# EAGLE design Spectroscilloscope Revised_4 (EAGLE 9.6.2)
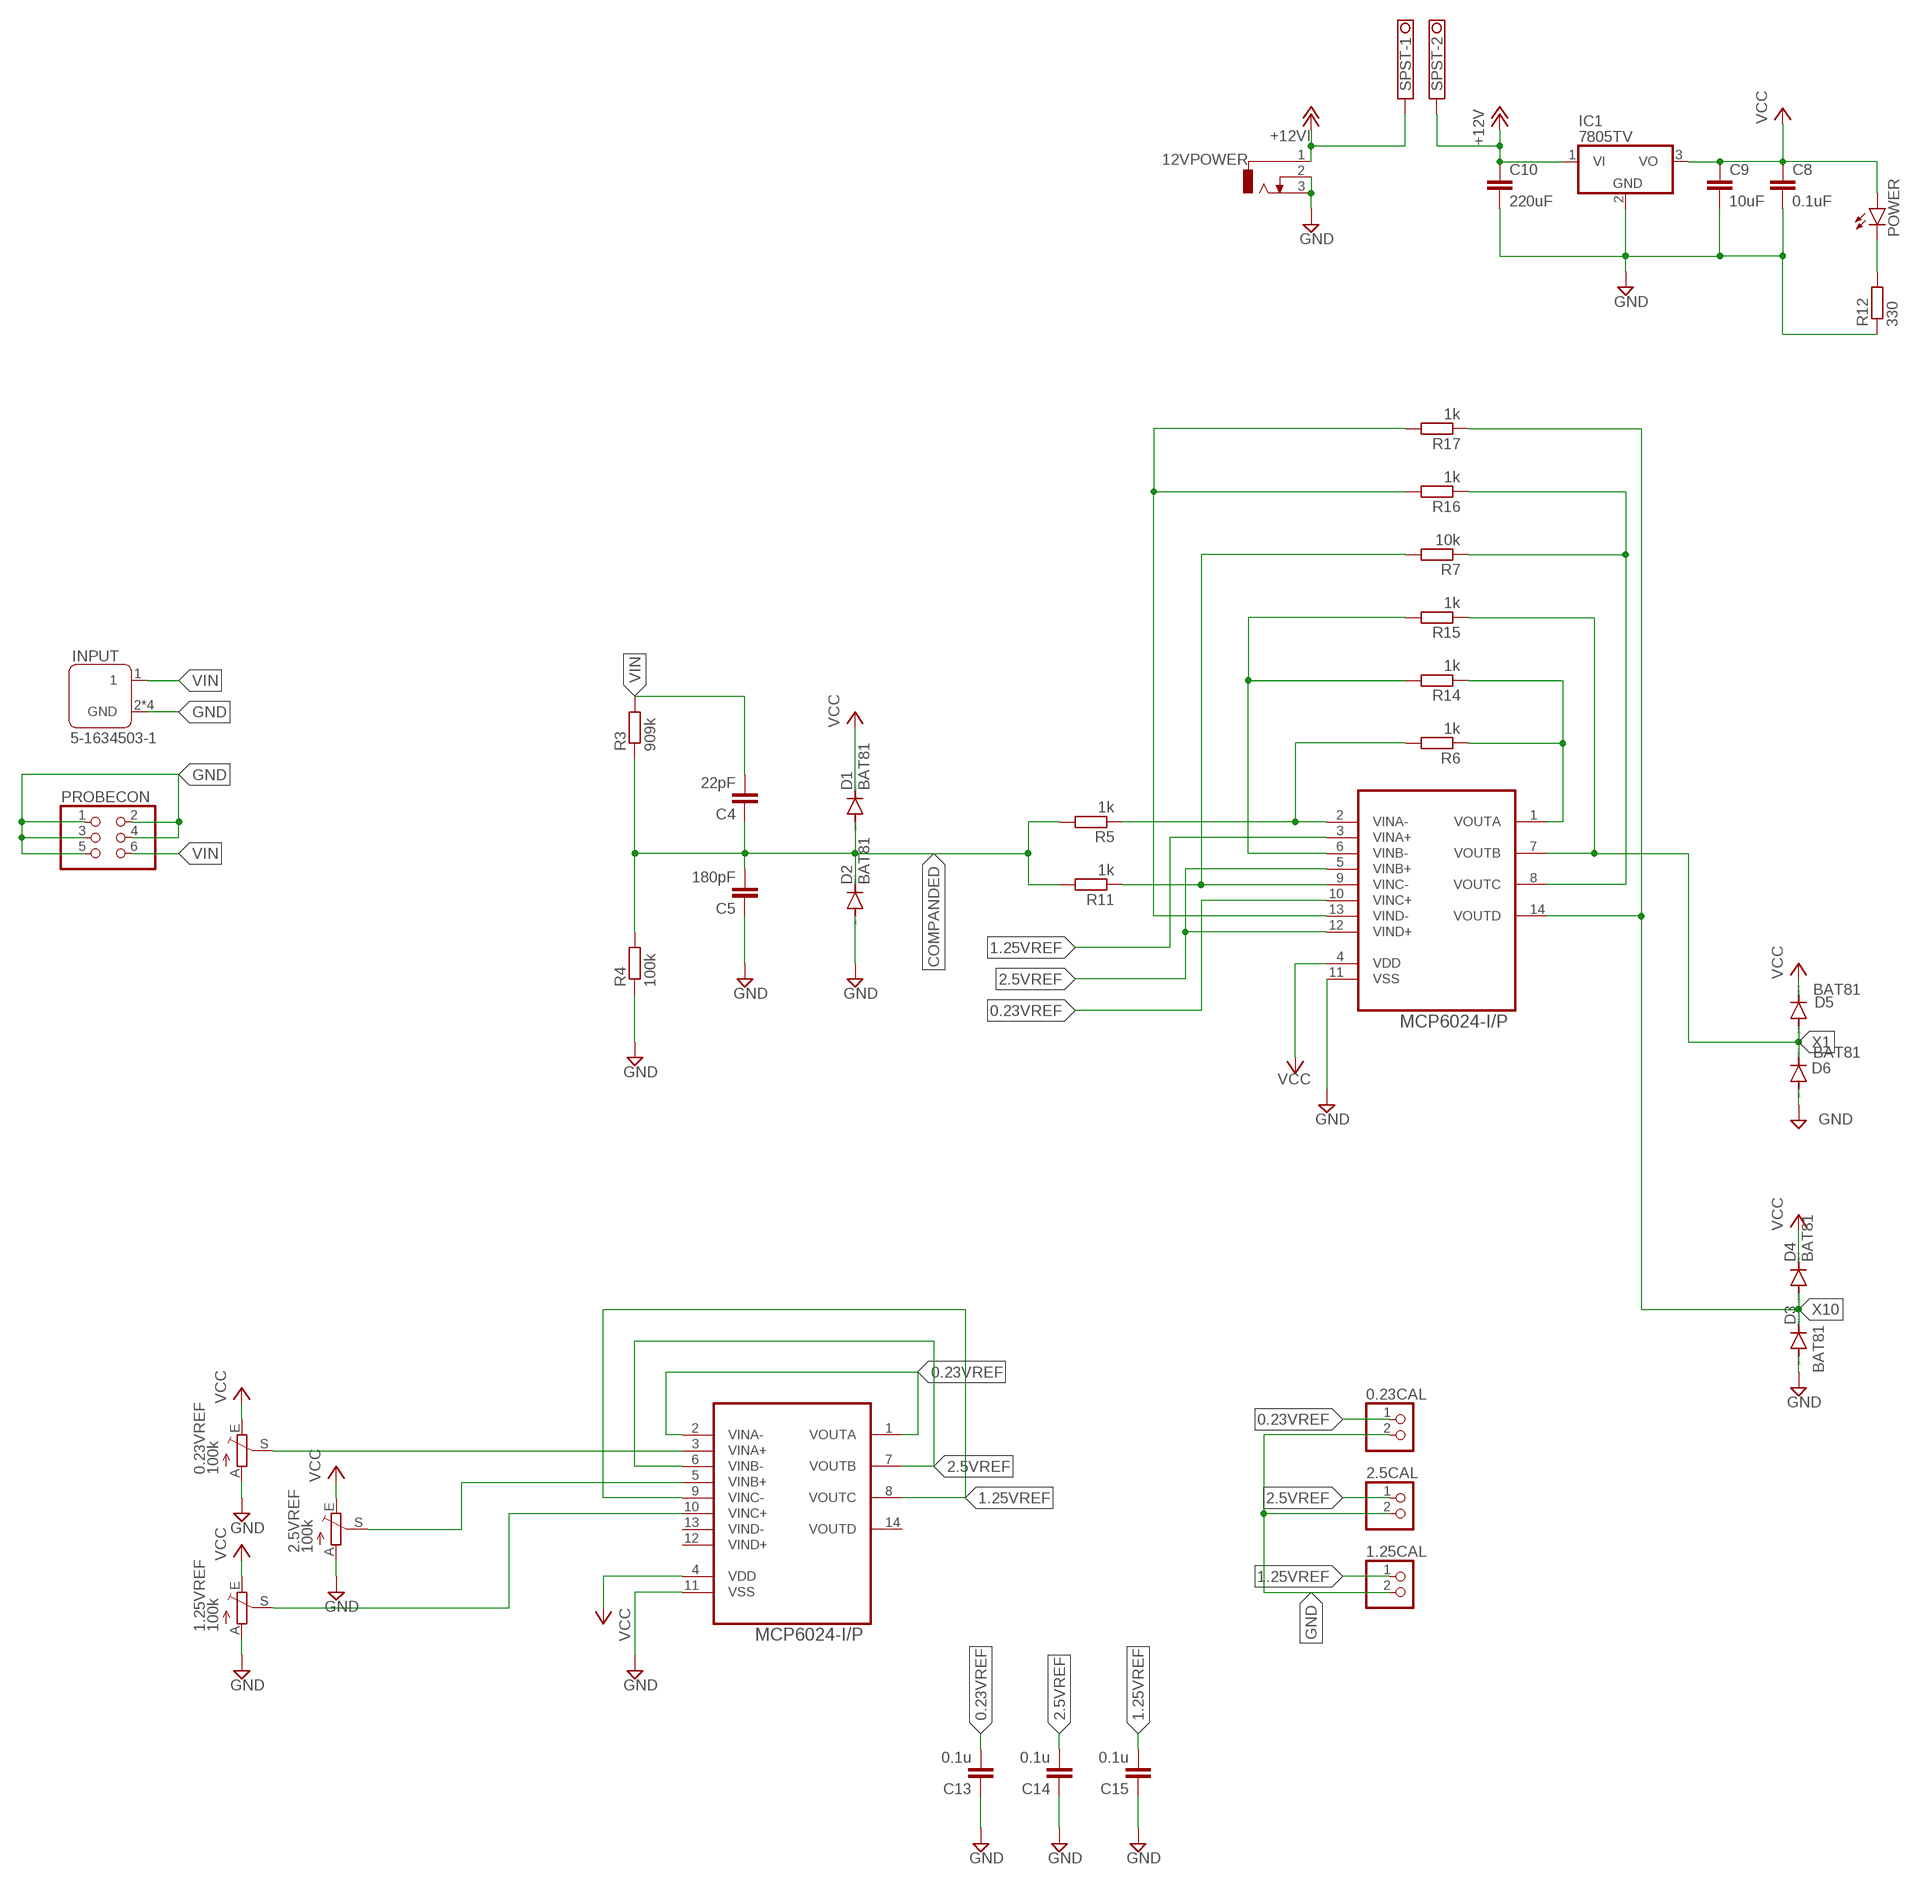
[diagram p0: schematic, sheet 1, part 1 of 2]
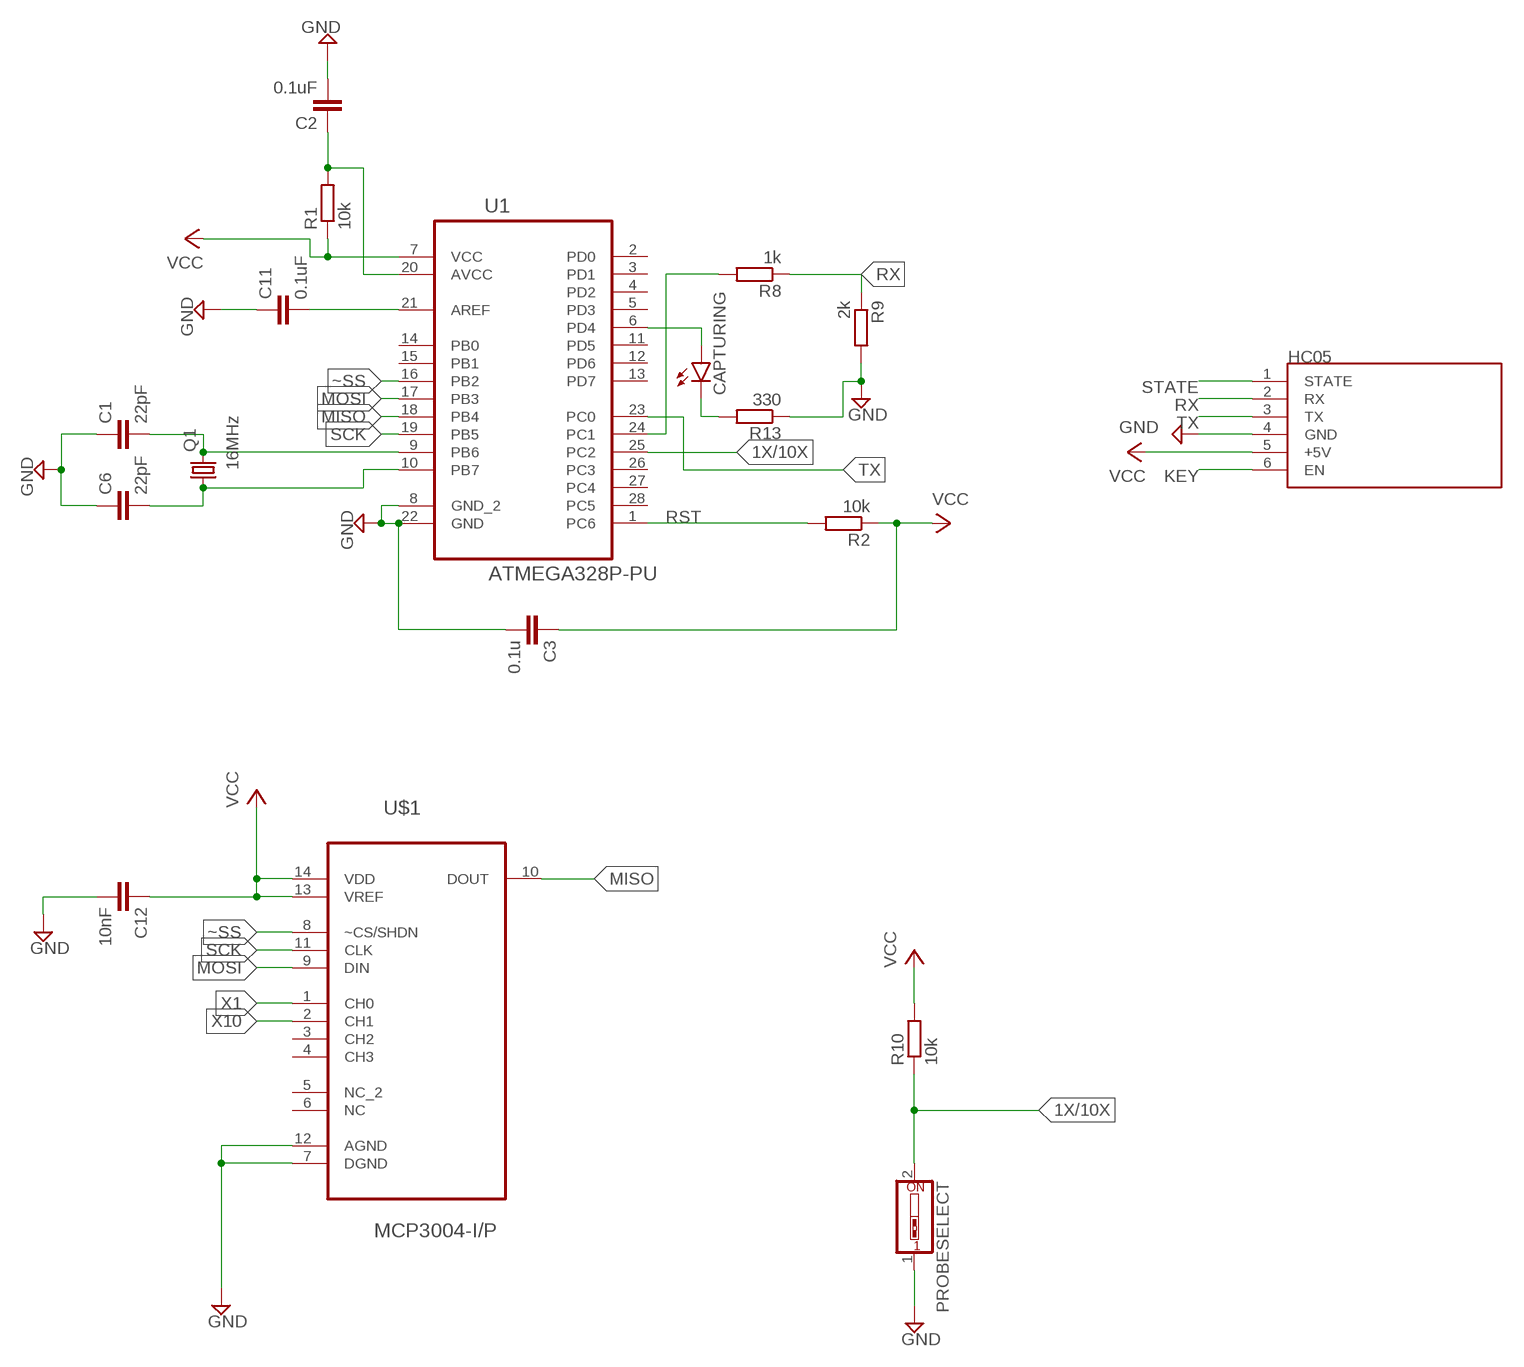
[diagram p1: schematic, sheet 1, part 2 of 2]

## Parts
0.23CAL  PINHD-1X2  [1X02]
0.23VREF  100k  TRIM_EU-B25P  [B25P]
1.25CAL  PINHD-1X2  [1X02]
1.25VREF  100k  TRIM_EU-B25P  [B25P]
2.5CAL  PINHD-1X2  [1X02]
2.5VREF  100k  TRIM_EU-B25P  [B25P]
12VPOWER  DCJ0303  [DCJ0303]
C1  22pF  C-EU050-024X044  [C050-024X044]
C2  0.1uF  C-EU050-024X044  [C050-024X044]
C3  0.1u  C-EU050-024X044  [C050-024X044]
C4  22pF  C-EU050-024X044  [C050-024X044]
C5  180pF  C-EU050-024X044  [C050-024X044]
C6  22pF  C-EU050-024X044  [C050-024X044]
C8  0.1uF  C-EU050-024X044  [C050-024X044]
C9  10uF  C-EU050-024X044  [C050-024X044]
C10  220uF  C-EU050-024X044  [C050-024X044]
C11  0.1uF  C-EU050-024X044  [C050-024X044]
C12  10nF  C-EU050-024X044  [C050-024X044]
C13  0.1u  C-EU050-024X044  [C050-024X044]
C14  0.1u  C-EU050-024X044  [C050-024X044]
C15  0.1u  C-EU050-024X044  [C050-024X044]
CAPTURING  LED5MM  [LED5MM]
D1  BAT81  [DO34-7]
D2  BAT81  [DO34-7]
D3  BAT81  [DO34-7]
D4  BAT81  [DO34-7]
D5  BAT81  [DO34-7]
D6  BAT81  [DO34-7]
HC05  WIRELESS-BLUETOOTH-HC-05  [WIRELESS-BLUETOOTH-HC-05]
IC1  7805TV  [TO220V]
INPUT  5-1634503-1  [TE_5-1634503-1]
POWER  LED5MM  [LED5MM]
PROBECON  PINHD-2X3  [2X03]
PROBESELECT  SW_DIP-1  [EDG-01]
Q1  16MHz  CRYSTALHC49U-V  [HC49U-V]
R1  10k  R-EU_0204/7  [0204/7]
R2  10k  R-EU_0204/7  [0204/7]
R3  909k  R-EU_0204/7  [0204/7]
R4  100k  R-EU_0204/7  [0204/7]
R5  1k  R-EU_0204/7  [0204/7]
R6  1k  R-EU_0204/7  [0204/7]
R7  10k  R-EU_0204/7  [0204/7]
R8  1k  R-EU_0204/7  [0204/7]
R9  2k  R-EU_0204/7  [0204/7]
R10  10k  R-EU_0204/7  [0204/7]
R11  1k  R-EU_0204/7  [0204/7]
R12  330  R-EU_0204/7  [0204/7]
R13  330  R-EU_0204/7  [0204/7]
R14  1k  R-EU_0204/7  [0204/7]
R15  1k  R-EU_0204/7  [0204/7]
R16  1k  R-EU_0204/7  [0204/7]
R17  1k  R-EU_0204/7  [0204/7]
SPST  TERMINAL-BLOCK-3.5MM-2-PIN-LONG-PAD  [TERMINAL-BLOCK-2-PIN-3.5MM-LONG-PAD]
U1  ATMEGA328P-PU  [DIP254P762X457-28]
U2  MCP6024-I/P  [DIP254P762X533-14]
U3  MCP6024-I/P  [DIP254P762X533-14]
U$1  MCP3004-I/P  [DIP254P762X432-14]

## Nets
0.23VREF: 0.23CAL.1 C13.2 U2.10(VINC+) U3.1(VOUTA) U3.2(VINA-)
1.25VREF: 1.25CAL.1 C15.2 U2.3(VINA+) U3.8(VOUTC) U3.9(VINC-)
1X/10X: PROBESELECT.2 R10.1 U1.25(PC2)
2.5VREF: 2.5CAL.1 C14.2 U2.5(VINB+) U2.12(VIND+) U3.6(VINB-) U3.7(VOUTB)
+12V [Power Lines]: C10.1 IC1.1(VI) SPST.2
+12VI [Power Lines]: 12VPOWER.1 SPST.1 ; supply symbol labelled +12V
CAPTURING: CAPTURING.A U1.6(PD4)
COMPANDED: C4.1 C5.2 D1.A D2.C R3.1 R4.2 R5.2 R11.2
GND [Power Lines]: 0.23CAL.2 0.23VREF.A 1.25CAL.2 1.25VREF.A 2.5CAL.2 2.5VREF.A 12VPOWER.2 12VPOWER.3 C1.1 C2.2 C3.2 C5.1 C6.1 C8.2 C9.2 C10.2 C11.1 C12.2 C13.1 C14.1 C15.1 D2.A D3.A D6.A HC05.4(GND) IC1.2(GND) INPUT.2(GND) INPUT.3(GND) INPUT.4(GND) INPUT.5(GND) PROBECON.1 PROBECON.2 PROBECON.3 PROBECON.4 PROBECON.5 PROBESELECT.1 R4.1 R9.2 R12.1 R13.1 U1.8(GND_2) U1.22(GND) U2.11(VSS) U3.11(VSS) U$1.7(DGND) U$1.12(AGND)
KEY: HC05.6(EN)
MISO: U1.18(PB4) U$1.10(DOUT)
MOSI: U1.17(PB3) U$1.9(DIN)
N$1: C1.2 Q1.2 U1.9(PB6)
N$2: C6.2 Q1.1 U1.10(PB7)
N$3: 2.5VREF.S U3.5(VINB+)
N$4: R6.1 R14.1 U2.1(VOUTA)
N$5: R5.1 R6.2 U2.2(VINA-)
N$6: C11.2 U1.21(AREF)
N$7: 1.25VREF.S U3.10(VINC+)
N$8: C2.1 R1.2 U1.20(AVCC)
N$9: 0.23VREF.S U3.3(VINA+)
N$12: POWER.K(C) R12.2
N$13: CAPTURING.K(C) R13.2
N$15: R14.2 R15.2 U2.6(VINB-)
N$16: R7.2 R11.1 U2.9(VINC-)
N$17: R8.2 U1.24(PC1)
N$21: R16.2 R17.2 U2.13(VIND-)
N$22: R7.1 R16.1 U2.8(VOUTC)
RST: R2.2 U1.1(PC6)
RX: HC05.2(RX) R8.1 R9.1
SCK: U1.19(PB5) U$1.11(CLK)
STATE: HC05.1(STATE)
TX: HC05.3(TX) U1.23(PC0)
VCC [Power Lines]: 0.23VREF.E 1.25VREF.E 2.5VREF.E C3.1 C8.1 C9.1 C12.1 D1.C D4.C D5.C HC05.5(+5V) IC1.3(VO) POWER.A R1.1 R2.1 R10.2 U1.7(VCC) U2.4(VDD) U3.4(VDD) U$1.13(VREF) U$1.14(VDD)
VIN: C4.2 INPUT.1 PROBECON.6 R3.2
X1: D5.A D6.C R15.1 U2.7(VOUTB) U$1.1(CH0)
X10: D3.C D4.A R17.1 U2.14(VOUTD) U$1.2(CH1)
~SS: U1.16(PB2) U$1.8(~CS/SHDN)
Unconnected: U1.2(PD0) U1.3(PD1) U1.4(PD2) U1.5(PD3) U1.11(PD5) U1.12(PD6) U1.13(PD7) U1.14(PB0) U1.15(PB1) U1.26(PC3) U1.27(PC4) U1.28(PC5) U3.12(VIND+) U3.13(VIND-) U3.14(VOUTD) U$1.3(CH2) U$1.4(CH3) U$1.5(NC_2) U$1.6(NC)

## Library data of the parts
0.23CAL 1.25CAL 2.5CAL = pinhead:PINHD-1X2: PIN HEADER
0.23VREF 1.25VREF 2.5VREF = pot:TRIM_EU-: POTENTIOMETER
12VPOWER = con-jack:DCJ0303: DC POWER JACK Source: DCJ0303.pdf
C1-C6 C8-C15 = rcl:C-EU: CAPACITOR, European symbol; SPICEPREFIX: C
CAPTURING POWER = led:LED: LED OSRAM: - CHIPLED LG R971, LG N971, LY N971, LG Q971, LY Q971, LO R971, LY R971 LH N974, LH R974 LS Q976, LO Q976, LY Q976 LO Q996 - Hyper CHIPLED LW Q18S LB Q993, LB Q99A, LB R99A - SideLED LS A670, LO A670, LY A670, LG A670, LP A670 LB A673, LV A673, LT A673, LW A673 LH A674 LY A675 LS A676, LA A676, LO A676, LY A676, LW A676 LS A679, LY A679, LG A679 - Hyper Micro SIDELED® LS Y876, LA Y876, LO Y876, LY Y876 LT Y87S - SmartLED LW L88C, LW L88S LB L89C, LB L89S, LG L890 LS L89K, LO L89K, LY L89K LS L896, LA L896, LO L896, LY L896 - TOPLED LS T670, LO T670, LY T670, LG T670, LP T670 LSG T670, LSP T670, LSY T670, LOP T670, LYG T670 LG T671, LOG T671, LSG T671 LB T673, LV T673, LT T673, LW T673 LH T674 LS T676, LA T676, LO T676, LY T676, LB T676, LH T676, LSB T676, LW T676 LB T67C, LV T67C, LT T67C, LS T67K, LO T67K, LY T67K, LW E67C LS E67B, LA E67B, LO E67B, LY E67B, LB E67C, LV E67C, LT E67C LW T67C LS T679, LY T679, LG T679 LS T770, LO T770, LY T770, LG T770, LP T770 LB T773, LV T773, LT T773, LW T773 LH T774 LS E675, LA E675, LY E675, LS T675 LS T776, LA T776, LO T776, LY T776, LB T776 LHGB T686 LT T68C, LB T68C - Hyper Mini TOPLED® LB M676 - Mini TOPLED Santana® LG M470 LS M47K, LO M47K, LY M47K Source: http://www.osram.convergy.de LUXEON: - LUMILED® LXK2-PW12-R00, LXK2-PW12-S00, LXK2-PW14-U00, LXK2-PW14-V00 LXK2-PM12-R00, LXK2-PM12-S00, LXK2-PM14-U00 LXK2-PE12-Q00, LXK2-PE12-R00, LXK2-PE12-S00, LXK2-PE14-T00, LXK2-PE14-U00 LXK2-PB12-K00, LXK2-PB12-L00, LXK2-PB12-M00, LXK2-PB14-N00, LXK2-PB14-P00, LXK2-PB14-Q00 LXK2-PR12-L00, LXK2-PR12-M00, LXK2-PR14-Q00, LXK2-PR14-R00 LXK2-PD12-Q00, LXK2-PD12-R00, LXK2-PD12-S00 LXK2-PH12-R00, LXK2-PH12-S00 LXK2-PL12-P00, LXK2-PL12-Q00, LXK2-PL12-R00 Source: www.luxeon.com KINGBRIGHT: KA-3528ASYC Source: www.kingbright.com
D1-D6 = diode:BAT81: DIODE barrier diode
HC05 = diy-modules:WIRELESS-BLUETOOTH-HC-05: Bluetooth Transceiver Module based on HC-05 board Tutorial is available here: https://arduino-info.wikispaces.com/BlueTooth-HC05-HC06-Modules-How-To Click here to find device on ebay.com <http://www.ebay.com/sch/hc-05+module+rs232>
IC1 = linear:78*: Positive VOLTAGE REGULATOR Source: http://cache.national.com/ds/LM/LM78L05.pdf http://www.fairchildsemi.com/ds/LM/LM7805.pdf
INPUT = 5-1634503-1:5-1634503-1: CONN BNC JACK STR 50 OHM PCB Check prices <https://pricing.snapeda.com/parts/5-1634503-1/TE%20Connectivity/view-part?ref=eda>; AVAILABILITY: Good; COMMENT: 5-1634503-1; DESCRIPTION: Rf / Coaxial Connector, Bnc Coaxial, Straight Jack, Solder, 50 Ohm, Brass; EU_ROHS_COMPLIANCE: Compliant; MF: TE Connectivity; MP: 5-1634503-1; NUMBER_OF_POSITIONS: 1; PACKAGE: None; PRICE: None; PURCHASE-URL: https://pricing.snapeda.com/search/part/5-1634503-1/?ref=eda
PROBECON = pinhead:PINHD-2X3: PIN HEADER
PROBESELECT = special:SW_DIP-1: DIP SWITCH
Q1 = crystal:CRYSTAL: CRYSTAL; OC_FARNELL: 1666969; OC_NEWARK: unknown
R1-R17 = rcl:R-EU_: RESISTOR, European symbol; SPICEPREFIX: R
SPST = Rembrandt Electronics - Terminal Block 3-5mm v1-0:TERMINAL-BLOCK-3.5MM-2-PIN: Terminal Block 3.5mm Pitch: 3,5 mm Number of pins: 2 Created by Rembrandt Electronics www.rembrandtelectronics.com
U1 = ATMEGA328P-PU:ATMEGA328P-PU: 8-bit Microcontroller with In-System Programmable Flash Buy Part <https://snapeda.com/parts/ATMEGA328P-PU/Microchip/view-part/?ref=eda>; AVAILABILITY: Good; DESCRIPTION: AVR AVR® ATmega Microcontroller IC 8-Bit 20MHz 32KB (16K x 16) FLASH 28-PDIP; DIGIKEY-PURCHASE-URL: https://snapeda.com/shop?store=DigiKey&id=2895131; MF: Microchip; MOUSER-PURCHASE-URL: https://snapeda.com/shop?store=Mouser&id=2895131; MP: ATMEGA328P-PU; PACKAGE: DIP-28 Generic; PRICE: None
U2 U3 = MCP6024-I_P:MCP6024-I/P: IC OPAMP 2.5V QUAD R-R Check prices <https://pricing.snapeda.com/parts/MCP6024-I/P/Microchip%20Technology/view-part?ref=eda>; AVAILABILITY: Warning; DESCRIPTION: IC OPAMP GP 4 CIRCUIT 14DIP; MF: Microchip Technology; MP: MCP6024-I/P; PACKAGE: None; PRICE: None; PURCHASE-URL: https://pricing.snapeda.com/search/part/MCP6024-I/P/?ref=eda
U$1 = MCP3004-I_P:MCP3004-I/P: A/D Converters; AVAILABILITY: Unavailable; DESCRIPTION: 10 Bit Analog to Digital Converter 2, 4 Input 1 SAR 14-PDIP; MF: Microchip; MP: MCP3004-I/P; PACKAGE: DIP-14 Microchip; PRICE: None

## Net classes
0 default: width 0.406 mm, clearance 0.102 mm
1 Power Lines: width 0.762 mm, clearance 0.13 mm

## Board
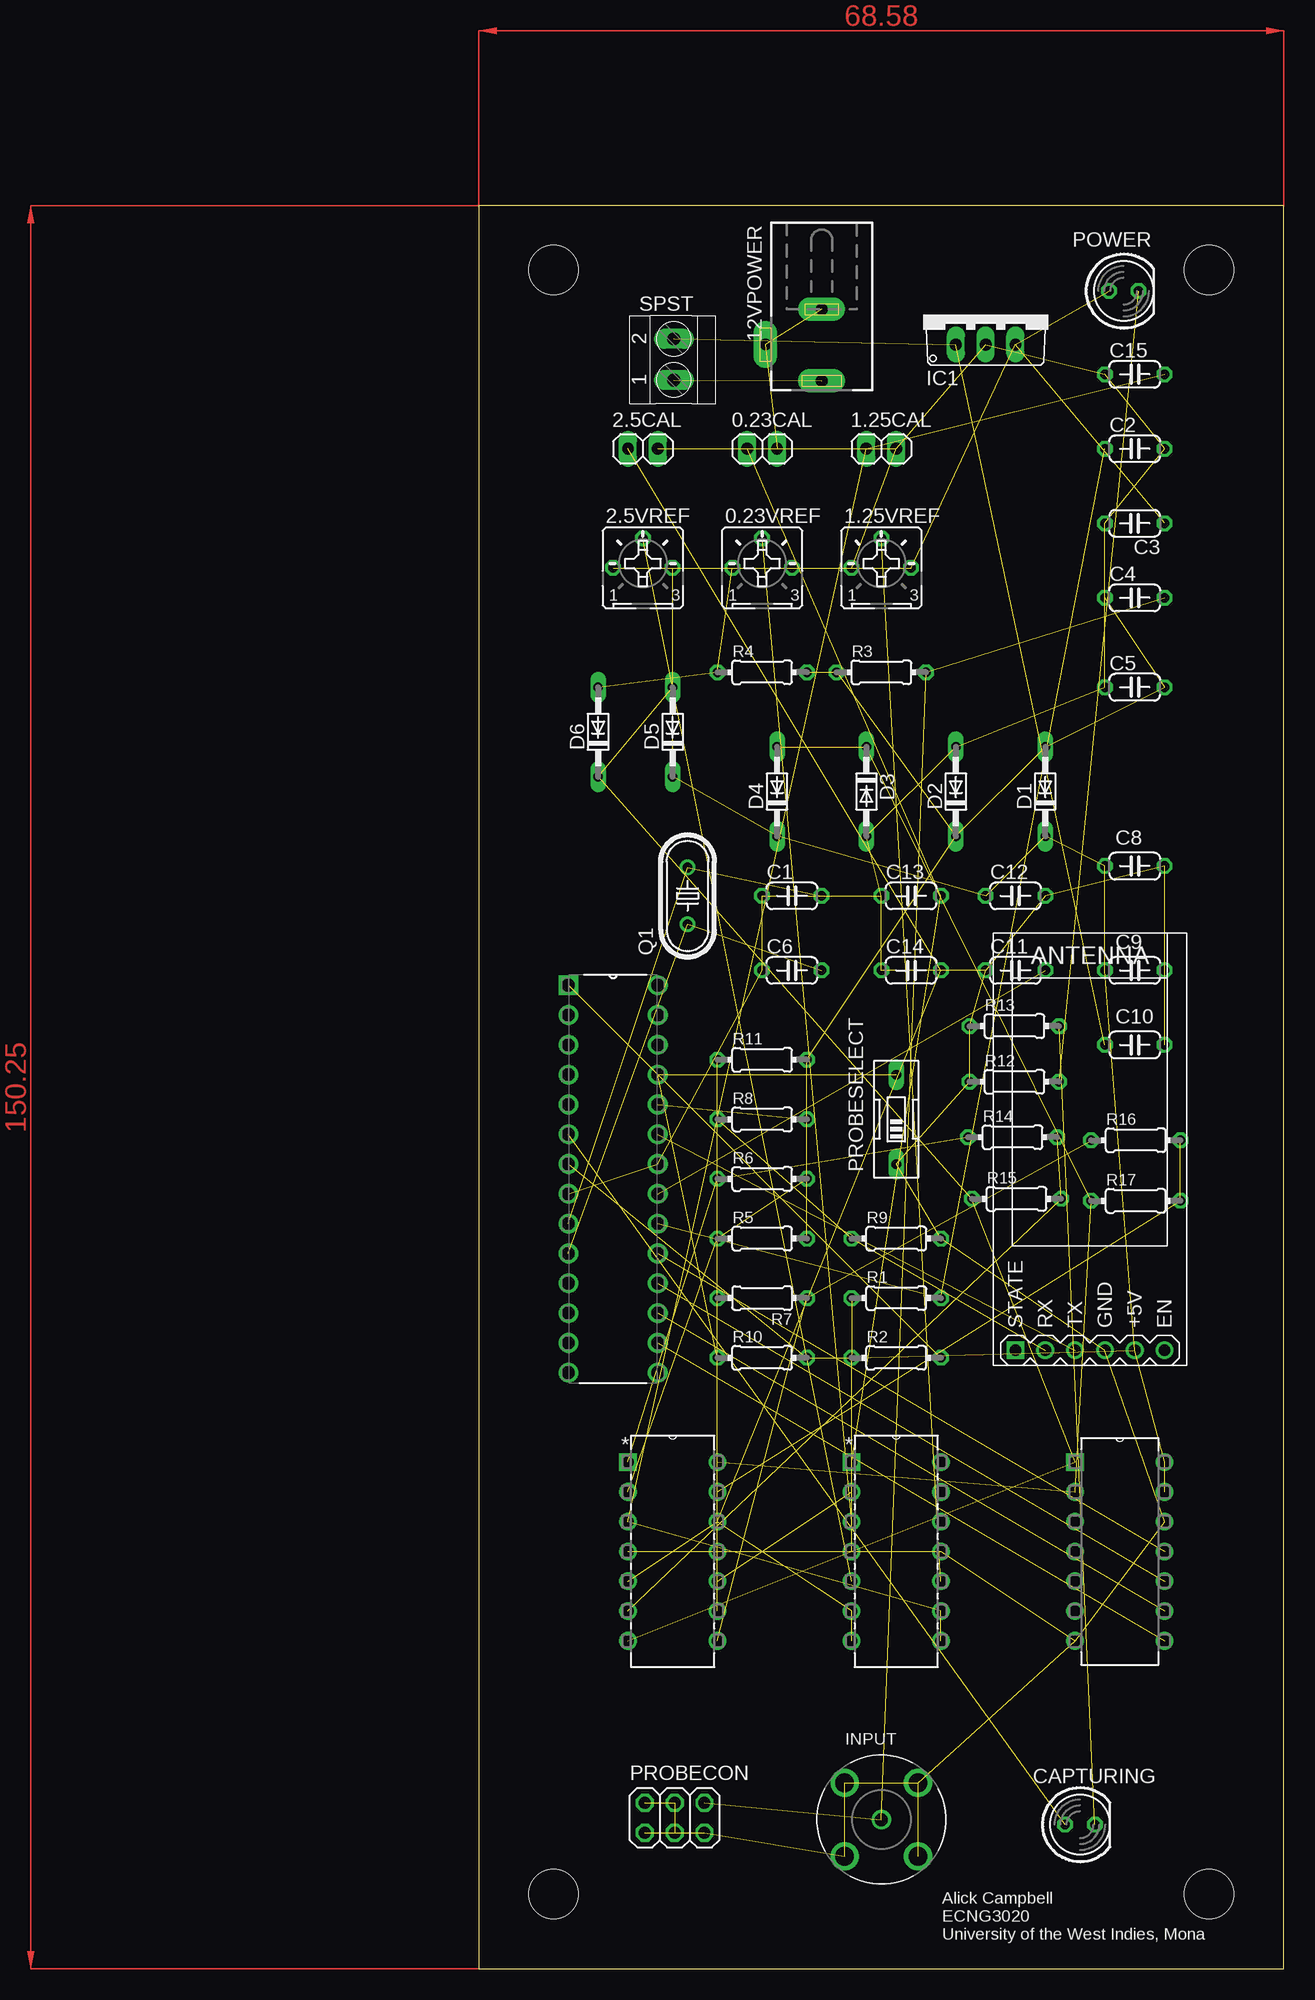
[diagram p2: board, top side]
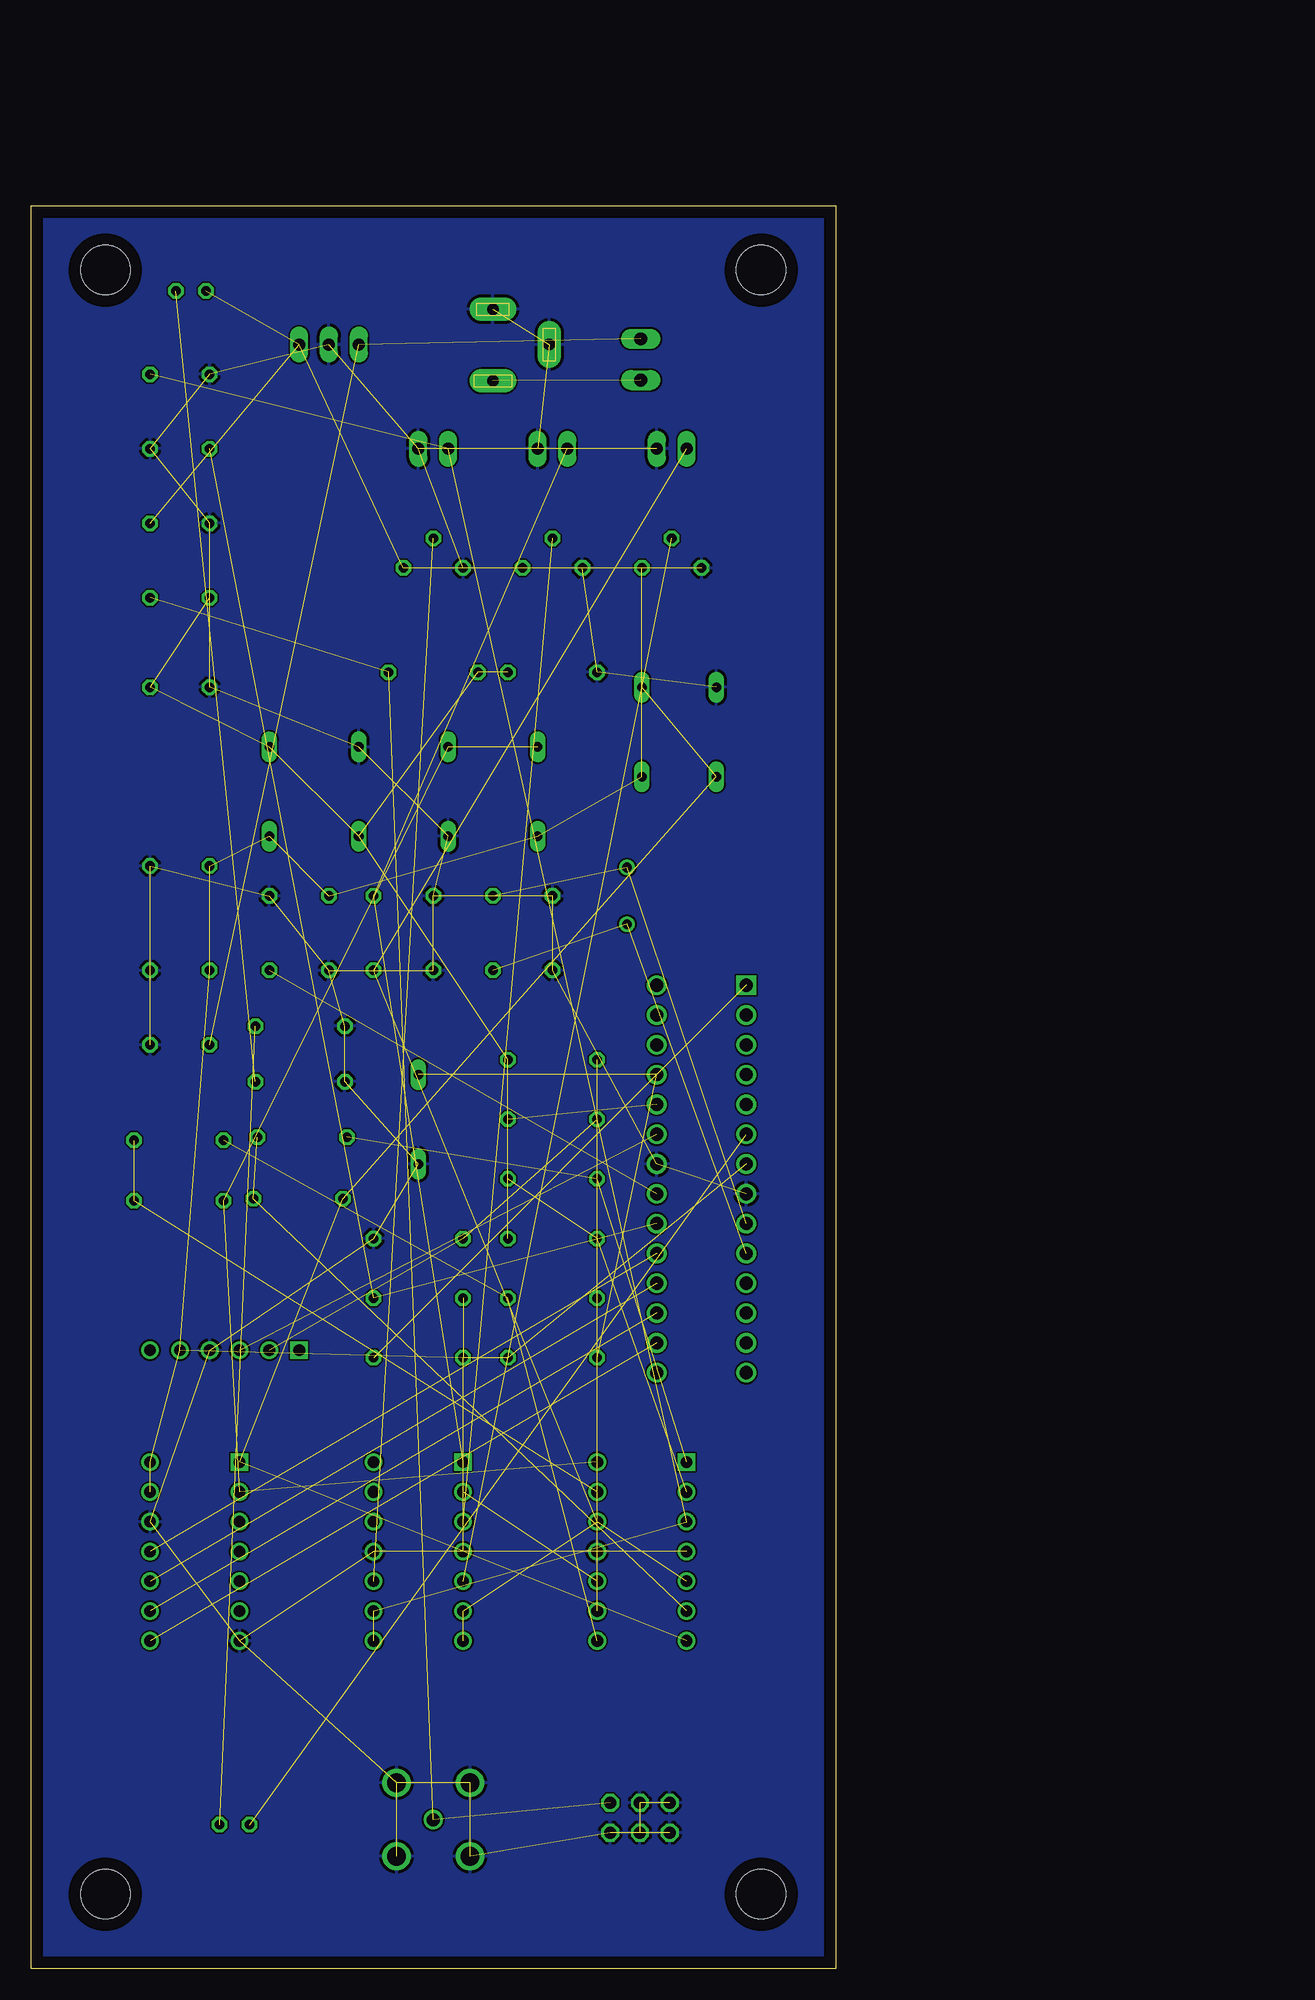
[diagram p3: board, bottom side, seen from below]

Size 68.56 x 150.25 mm. Coordinates in mm from the lower left corner, seen from the top.
Outline: 0,0 68.56,0 68.56,150.25 0,150.25 0,0
Copper layers (1*16): Top 0.035mm / dielectric 1.5mm / Bottom 0.035mm
Design rules "default": minimum track width 6mil, minimum drill 0.35mm, track to track 6mil, track to pad 6mil, pad to pad 6mil, via to via 6mil, smd to smd 6mil, copper to edge 40mil, drill to drill 6mil, minimum pad ring 10mil, minimum via ring 8mil, stop-mask expansion 4mil, vias tented up to drill 0mil, thermal gap 10mil
Holes 4.2 mm at 6.35,6.35 62.23,6.35 62.23,144.78 6.35,144.78

### Footprints (pad centres in the part's own frame; a part is rotated, then mirrored left to right if it is on the bottom)
1X02 = drill 1.016 long: 1 -1.27,0; 2 1.27,0
B25P = drill 0.813 octagon: A -2.54,0; E 2.54,0; S 0,2.54
DCJ0303 = drill 1 pad 2 long: 1 0,3.1; 2 4.8,0; 3 0,-3
C050-024X044 = drill 0.813 octagon: 1 -2.54,0; 2 2.54,0
LED5MM = drill 0.813 octagon: A -1.27,0; K 1.27,0
DO34-7 = drill 0.813 long: A 3.81,0; C -3.81,0
WIRELESS-BLUETOOTH-HC-05 = drill 1 square: 1 -6.35,-17.145 | drill 1: 2 -3.81,-17.145; 3 -1.27,-17.145; 4 1.27,-17.145; 5 3.81,-17.145; 6 6.35,-17.145
TO220V = drill 1.016 long: 1 -2.54,-2.54; 2 0,-2.54; 3 2.54,-2.54
TE_5-1634503-1 = drill 1.1: 1 0,0 | drill 1.6: 2 -3.13,3.13; 3 3.13,3.13; 4 3.13,-3.13; 5 -3.13,-3.13
2X03 = drill 1.016 octagon: 1 -2.54,-1.27; 2 -2.54,1.27; 3 0,-1.27; 4 0,1.27; 5 2.54,-1.27; 6 2.54,1.27
EDG-01 = drill 0.813 long: 1 0,-3.81; 2 0,3.81
HC49U-V = drill 0.813: 1 -2.413,0; 2 2.413,0
0204/7 = drill 0.813 octagon: 1 -3.81,0; 2 3.81,0
TERMINAL-BLOCK-2-PIN-3.5MM-LONG-PAD = drill 1.1 pad 1.7 long: 1 -1.75,-0.1; 2 1.75,-0.1
DIP254P762X457-28 = drill 1.118 square: 1 -7.62,33.02 | drill 1.118: 2 -7.62,30.48; 3 -7.62,27.94; 4 -7.62,25.4; 5 -7.62,22.86; 6 -7.62,20.32; 7 -7.62,17.78; 8 -7.62,15.24; 9 -7.62,12.7; 10 -7.62,10.16; 11 -7.62,7.62; 12 -7.62,5.08; 13 -7.62,2.54; 14 -7.62,0; 15 0,0; 16 0,2.54; 17 0,5.08; 18 0,7.62; 19 0,10.16; 20 0,12.7; 21 0,15.24; 22 0,17.78; 23 0,20.32; 24 0,22.86; 25 0,25.4; 26 0,27.94; 27 0,30.48; 28 0,33.02
DIP254P762X533-14 = drill 0.991 square: 1 -7.62,15.24 | drill 0.991: 2 -7.62,12.7; 3 -7.62,10.16; 4 -7.62,7.62; 5 -7.62,5.08; 6 -7.62,2.54; 7 -7.62,0; 8 0,0; 9 0,2.54; 10 0,5.08; 11 0,7.62; 12 0,10.16; 13 0,12.7; 14 0,15.24
DIP254P762X432-14 = drill 0.991 square: 1 -7.62,15.24 | drill 0.991: 2 -7.62,12.7; 3 -7.62,10.16; 4 -7.62,7.62; 5 -7.62,5.08; 6 -7.62,2.54; 7 -7.62,0; 8 0,0; 9 0,2.54; 10 0,5.08; 11 0,7.62; 12 0,10.16; 13 0,12.7; 14 0,15.24

### Placement (x,y rotation side)
0.23CAL  24.13,129.54 0 top
0.23VREF  24.13,119.38 0 top
1.25CAL  34.29,129.54 0 top
1.25VREF  34.29,119.38 0 top
2.5CAL  13.97,129.54 0 top
2.5VREF  13.97,119.38 0 top
12VPOWER  29.21,138.43 180 top
C1  26.67,91.44 0 top
C2  55.88,129.54 0 top
C3  55.88,123.19 180 top
C4  55.88,116.84 0 top
C5  55.88,109.22 0 top
C6  26.67,85.09 0 top
C8  55.88,93.98 0 top
C9  55.88,85.09 0 top
C10  55.88,78.74 0 top
C11  45.72,85.09 0 top
C12  45.72,91.44 0 top
C13  36.83,91.44 0 top
C14  36.83,85.09 0 top
C15  55.88,135.89 0 top
CAPTURING  51.22,12.27 0 top
D1  48.26,100.33 90 top
D2  40.64,100.33 90 top
D3  33.02,100.33 270 top
D4  25.4,100.33 90 top
D5  16.51,105.41 90 top
D6  10.16,105.41 90 top
HC05  52.07,69.85 0 top
IC1  43.18,140.97 0 top
INPUT  34.29,12.7 0 top
POWER  54.94,142.98 0 top
PROBECON  16.68,12.86 0 top
PROBESELECT  35.56,72.39 0 top
Q1  17.78,91.44 90 top
R1  35.56,57.15 0 top
R2  35.56,52.07 0 top
R3  34.29,110.49 0 top
R4  24.13,110.49 0 top
R5  24.13,62.23 0 top
R6  24.13,67.31 0 top
R7  24.13,57.15 180 top
R8  24.13,72.39 0 top
R9  35.56,62.23 0 top
R10  24.13,52.07 0 top
R11  24.13,77.47 0 top
R12  45.63,75.6 0 top
R13  45.63,80.34 0 top
R14  45.47,70.87 0 top
R15  45.81,65.61 0 top
R16  55.97,70.61 0 top
R17  55.97,65.45 0 top
SPST  16.51,137.16 90 top
U1  15.24,50.8 0 top
U2  20.32,27.94 0 top
U3  39.37,27.94 0 top
U$1  58.42,27.94 0 top

### Tracks (layer width: path | path; a pad name or v marks a point on that pad's centre or on a via)
0.23VREF  (4 unrouted)
1.25VREF  (4 unrouted)
1X/10X  (2 unrouted)
2.5VREF  (5 unrouted)
+12V  (2 unrouted)
+12VI  (1 unrouted)
CAPTURING  (1 unrouted)
COMPANDED  (7 unrouted)
GND  (45 unrouted)
  pour Bottom: 0,0 68.58,0 68.58,150.24 0,150.24
MISO  (1 unrouted)
MOSI  (1 unrouted)
N$1  (2 unrouted)
N$2  (2 unrouted)
N$3  (1 unrouted)
N$4  (2 unrouted)
N$5  (2 unrouted)
N$6  (1 unrouted)
N$7  (1 unrouted)
N$8  (2 unrouted)
N$9  (1 unrouted)
N$12  (1 unrouted)
N$13  (1 unrouted)
N$15  (2 unrouted)
N$16  (2 unrouted)
N$17  (1 unrouted)
N$21  (2 unrouted)
N$22  (2 unrouted)
RST  (1 unrouted)
RX  (2 unrouted)
SCK  (1 unrouted)
TX  (1 unrouted)
VCC  (20 unrouted)
VIN  (3 unrouted)
X1  (4 unrouted)
X10  (4 unrouted)
~SS  (1 unrouted)
(copper drawn outside any net)
  shapes: Top area x2

### Text on the board
tPlace: Alick Campbell / ECNG3020 / University of the West Indies, Mona